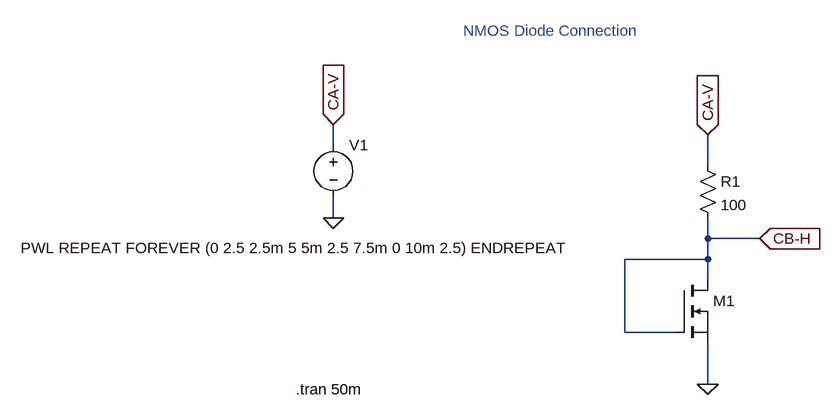
[diagram p0: schematic nmos_diode_conn_ltspice.asc]
nmos_diode_conn_ltspice.asc, the LTspice schematic file:
Version 4
SHEET 1 880 680
WIRE -352 -96 -352 -128
WIRE 224 -64 224 -112
WIRE -352 16 -352 -16
WIRE 224 48 224 16
WIRE 304 48 224 48
WIRE 224 80 224 48
WIRE 224 80 96 80
WIRE 224 112 224 80
WIRE 96 192 96 80
WIRE 176 192 96 192
WIRE 224 272 224 208
FLAG 224 272 0
FLAG 224 -112 CA-V
IOPIN 224 -112 In
FLAG -352 16 0
FLAG -352 -128 CA-V
IOPIN -352 -128 In
FLAG 304 48 CB-H
IOPIN 304 48 In
SYMBOL nmos 176 112 R0
WINDOW 3 56 72 Invisible 2
SYMATTR InstName M1
SYMATTR Value BSP89
SYMBOL res 208 -80 R0
SYMATTR InstName R1
SYMATTR Value 100
SYMBOL voltage -352 -112 R0
WINDOW 3 -481 174 Left 2
WINDOW 123 0 0 Left 0
WINDOW 39 0 0 Left 0
SYMATTR InstName V1
SYMATTR Value PWL REPEAT FOREVER (0 2.5 2.5m 5 5m 2.5 7.5m 0 10m 2.5) ENDREPEAT
TEXT -410 280 Left 2 !.tran 50m
TEXT -152 -272 Left 2 ;NMOS Diode Connection

The netlist it stands for:
* nmos_diode_conn_ltspice.asc
M1 CB-H CB-H 0 0 BSP89
R1 CA-V CB-H 100
V1 CA-V 0 PWL REPEAT FOREVER (0 2.5 2.5m 5 5m 2.5 7.5m 0 10m 2.5) ENDREPEAT
.model NMOS NMOS
.model PMOS PMOS
.lib standard.mos
.tran 50m
* NMOS Diode Connection
.backanno
.end